# Altium schematic sheet [3]-DCDC-3V3.SchDoc: [3]-DCDC-3V3
size A3; DocumentNumber: NA; Revision: 2019.12.17; SheetNumber: 3; SheetTotal: 3
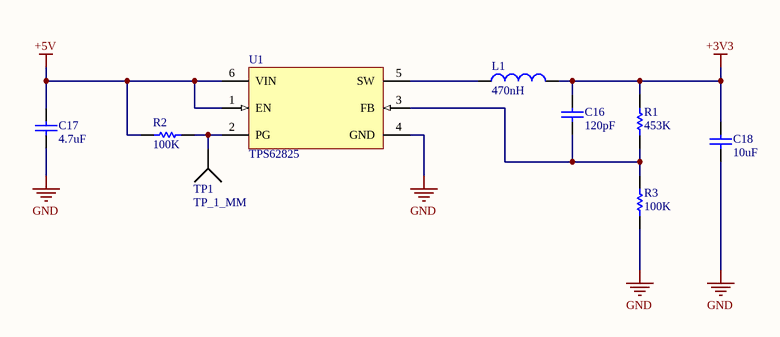
[diagram p0: [3]-DCDC-3V3.SchDoc]

## Parts
C16  120pF  [CAPC1005N]
C17  4.7uF  [CAPC2012N]
C18  10uF  [CAPC2012N]
L1  470nH  [IHLP-1212AE-11]
R1  453K  [RESC1005N]
R2  100K  [RESC1005N]
R3  100K  [RESC1005N]
TP1  TP_1_MM  [TP_1_MM]  (no BOM)
U1  TPS62825  [DMQ0006A]

## Nets
+3V3: C16.2 C18.2 L1.2 R1.2
+5V: C17.2 R2.1 U1.1(EN) U1.6(VIN)
GND: C17.1 C18.1 R3.1 U1.4(GND)
NetC16_1: C16.1 R1.1 R3.2 U1.3(FB)
NetL1_1: L1.1 U1.5(SW)
NetR2_2: R2.2 TP1.1 U1.2(PG)

## Library data of the parts
C16 = GRM1555C1H121FA01D: CAP CER 120PF 50V C0G/NP0 0402; Manufacturer 1: Murata; Description 1: Multilayer Ceramic Capacitors MLCC - SMD/SMT 0402 120pF 50volts 1%; Brand: Murata Electronics; Tolerance: 1 %; Dielectric: C0G (NP0); Case Height: 0.5 mm; Case Length: 1 mm; Temperature Coefficient / Code: +/- 30 PPM / C; Type: General Purpose MLCC; Material: Ceramic; Temperature Coefficient: 30ppm/°C; Supplier 1: Digi-Key; Stock 1: 154558; Pricing 1: 1=0.15, 10=0.107, 100=0.0501, 500=0.0351, 1000=0.0291, 2500=0.0271, 5000=0.0248 (USD); Voltage Rating: 50 V; Product Category: Multilayer Ceramic Capacitors MLCC - SMD/SMT; RoHS: Details; Capacitance: 120 pF; Voltage Rating DC: 50 V; Case Code - in: 0402; Case Code - mm: 1005; Minimum Operating Temperature: - 55 C; Maximum Operating Temperature: + 125 C; Product: General Type MLCCs; Case Width: 0.5 mm; Operating Temperature Range: - 55 C to + 125 C; Package / Case: 0402 (1005 metric); Packaging: Reel; Series: GRM; Factory Pack Quantity: 10000; Termination Style: SMD/SMT; Dimensions: 0.5 mm W x 1 mm L x 0.5 mm H; ComponentLink1URL: https://datasheet.ciiva.com/11617/c02e-11617455.pdf; ComponentLink1Description: https://datasheet.ciiva.com/11617/c02e-11617455.pdf; ComponentLink2URL: https://datasheet.ciiva.com/17451/c02e-17451502.pdf; ComponentLink2Description: https://datasheet.ciiva.com/17451/c02e-17451502.pdf; Supplier Part Number 1: 490-8182-1-ND; Supplier 2: Digi-Key; Manufacturer 2: Murata; Manufacturer Part Number 2: GRM1555C1H121JA01D; Stock 2: 100000; Pricing 2: 1=0.1, 10=0.065, 100=0.0289, 500=0.02066, 1000=0.01623, 2500=0.01475, 5000=0.01357 (USD); Mount: Surface Mount; Case/Package: 0402; Case Code (Imperial): 0402; Case Code (Metric): 1005; Min Operating Temperature: -55°C; Max Operating Temperature: 125°C; Voltage Rating (DC): 50V; Package Quantity: 1; Termination: SMD/SMT; Voltage: 50V; Length: 1mm; Height: 0.5mm; Width: 0.5mm; Thickness: 0.022inch; Depth: 0.5mm; Radiation Hardening: No; REACH SVHC: No SVHC; Lead Free: Lead Free; Manufacturer Part Number 1: GRM1555C1H121FA01D; Supplier Part Number 2: 490-1292-1-ND
C17 = C2012X5R1E475K125AB: CAP CER 4.7UF 25V X5R 0805; Manufacturer 1: TDK; Dielectric Material: Ceramic; Tolerance: 10%; Supplier 1: Digi-Key; Manufacturer Part Number 1: C2012X5R1E475K125AB; Stock 1: 20000; Pricing 1: 1=0.38, 10=0.259, 100=0.1466, 500=0.1035, 1000=0.09056 (USD); Mount: Surface Mount; Case/Package: 0805; Number of Pins: 2; Weight: 0.000194oz; Case Code (Imperial): 0805; Case Code (Metric): 2012; Min Operating Temperature: -55°C; Max Operating Temperature: 85°C; Capacitance: 4.7uF; Dielectric: X5R; Voltage Rating: 25V; Voltage Rating (DC): 25V; Packaging: Tape and Reel; Package Quantity: 1; Termination: SMD/SMT; Composition: Ceramic; Voltage: 25V; Length: 2mm; Height: 1.25mm; Depth: 1.25mm; Width: 1.25mm; Thickness: 0.057inch; Radiation Hardening: No; REACH SVHC: No SVHC; Lead Free: Lead Free; ComponentLink1URL: https://datasheet.ciiva.com/24216/tdkmlcccaprange-24216480.pdf; ComponentLink1Description: https://datasheet.ciiva.com/24216/tdkmlcccaprange-24216480.pdf; ComponentLink2URL: https://datasheet.ciiva.com/11788/0900766b80c1bb00-11788107.pdf; ComponentLink2Description: https://datasheet.ciiva.com/11788/0900766b80c1bb00-11788107.pdf; ComponentLink3URL: https://datasheet.ciiva.com/36857/1796654-36857301.pdf; ComponentLink3Description: https://datasheet.ciiva.com/36857/1796654-36857301.pdf; ComponentLink4URL: https://datasheet.ciiva.com/22773/1571323-22773430.pdf; ComponentLink4Description: https://datasheet.ciiva.com/22773/1571323-22773430.pdf; ComponentLink5URL: https://datasheet.ciiva.com/6251/tdkmlcccaprange-6251817.pdf; ComponentLink5Description: https://datasheet.ciiva.com/6251/tdkmlcccaprange-6251817.pdf; ComponentLink6URL: https://datasheet.ciiva.com/22676/1571323-22676937.pdf; ComponentLink6Description: https://datasheet.ciiva.com/22676/1571323-22676937.pdf; ComponentLink7URL: https://datasheet.ciiva.com/6251/tdkmlcccaprange-6251820.pdf; ComponentLink7Description: https://datasheet.ciiva.com/6251/tdkmlcccaprange-6251820.pdf; ComponentLink8URL: https://datasheet.ciiva.com/28602/1744655-28602173.pdf; ComponentLink8Description: https://datasheet.ciiva.com/28602/1744655-28602173.pdf; ComponentLink9URL: https://datasheet.ciiva.com/6251/tdkmlcccaprange-6251823.pdf; ComponentLink9Description: https://datasheet.ciiva.com/6251/tdkmlcccaprange-6251823.pdf; ComponentLink10URL: https://datasheet.ciiva.com/16449/e412-c-16449599.pdf; ComponentLink10Description: https://datasheet.ciiva.com/16449/e412-c-16449599.pdf; Supplier Part Number 1: 445-4116-1-ND
C18 = C2012X7R1A106K125AC: CAP CER 10UF 10V X7R 0805; Manufacturer 1: TDK; Dielectric Material: Ceramic; Tolerance: 10%; Supplier 1: Digi-Key; Manufacturer Part Number 1: C2012X7R1A106K125AC; Stock 1: 20000; Pricing 1: 1=0.52, 10=0.359, 100=0.2156, 500=0.16172, 1000=0.13656 (USD); Mount: Surface Mount; Case/Package: 0805; Number of Pins: 2; Weight: 0.000194oz; Case Code (Metric): 2012; Case Code (Imperial): 0805; Contact Plating: Matte,Tin; Min Operating Temperature: -55°C; Max Operating Temperature: 125°C; Capacitance: 10uF; Dielectric: X7R; Voltage Rating: 10V; Packaging: Tape and Reel; Voltage Rating (DC): 10V; Termination: SMD/SMT; Package Quantity: 1; Composition: Ceramic; Voltage: 10V; Length: 2mm; Height: 1.25mm; Width: 0.049inch; Depth: 1.25mm; Thickness: 0.057inch; Radiation Hardening: No; Lead Free: Lead Free; REACH SVHC: No SVHC; Supplier Part Number 1: 445-6857-1-ND
L1 = IHLP1212AEERR47M11: FIXED IND 470NH 6.7A 15 MOHM SMD; Manufacturer 1: Vishay Dale; Core Material: Ferrite; Tolerance: 20%; Self Resonant Frequency: 1MHz; Shielding: Shielded; DC Resistance (DCR): 15mR; Test Frequency: 100kHz; Supplier 1: Digi-Key; Manufacturer Part Number 1: IHLP1212AEERR47M11; Stock 1: 27366; Pricing 1: 1=1.41, 10=1.308, 100=0.9459, 500=0.7245, 1000=0.644 (USD); Mount: Surface Mount; Case/Package: 1212; Number of Pins: 2; Min Operating Temperature: -55°C; Max Operating Temperature: 125°C; Packaging: Tape and Reel; Inductance Tolerance: 20%; Package Quantity: 3000; Current Rating: 6.7A; Saturation Current: 6.7A; Inductance: 470nh; Max DC Current: 6.7A; Termination: SMD/SMT; RMS Current (Irms): 6.7A; Military Standard: Not; Length: 3.6mm; Height: 1.2mm; Width: 3mm; Height - Seated (Max): 0.059inch; Depth: 3.2mm; Radiation Hardening: No; REACH SVHC: Unknown; Lead Free: Lead Free; Supplier Part Number 1: 541-1330-1-ND
R1 = RMCF0402FT453K: RES SMD 453K OHM 1% 1/16W 0402; Manufacturer: Stackpole Electronics; Resistance: 453kR; Max Power Dissipation: 63mW; Temperature Coefficient: 100ppm/°C; Supplier 1: Digi-Key; Manufacturer Part Number: RMCF0402FT453K; Stock 1: 49261; Pricing 1: 1=0.10000, 10=0.01500, 100=0.00610, 1000=0.00275, 2500=0.00239, 5000=0.00198 (USD); RoHS: Yes; Mount: Surface Mount; Case/Package: 0402; Case Code (Metric): 1005; Case Code (Imperial): 0402; Contact Plating: Tin,Matte; Min Operating Temperature: -55°C; Max Operating Temperature: 155°C; Tolerance: 1%; Packaging: Tape and Reel; Composition: Thick Film; Number of Terminations: 2; Features: Automotive AEC-Q200; Length: 0.039inch; Height: 0.016inch; Width: 0.02inch; ComponentLink1URL: https://www.seielect.com/catalog/SEI-Packaging.pdf?src-supplier=Digi-Key; ComponentLink1Description: https://www.seielect.com/catalog/SEI-Packaging.pdf?src-supplier=Digi-Key; ComponentLink2URL: http://components.arrow.com/part/dataview/47827349S9775272N1174?src-supplier=Arrow; ComponentLink2Description: http://components.arrow.com/part/dataview/47827349S9775272N1174?src-supplier=Arrow; ComponentLink3URL: https://www.seielect.com/Catalog/SEI-RMCF_RMCP.pdf?src-supplier=Avnet; ComponentLink3Description: https://www.seielect.com/Catalog/SEI-RMCF_RMCP.pdf?src-supplier=Avnet; Supplier Part Number 1: RMCF0402FT453KCT-ND
R2 R3 = RC0402FR-07100KL: RES SMD 100K OHM 1% 1/16W 0402; Manufacturer 1: Yageo; Resistance: 100 kOhms; Power Rating: 62.5 mW (1/16 W); Voltage Rating: 50 V; Temperature Coefficient: 100 PPM / C; Supplier 1: Digi-Key; Manufacturer Part Number 1: RC0402FR-07100KL; Description 1: RES SMD 100K OHM 1% 1/16W 0402; Stock 1: 10691398; Pricing 1: 1=0.1, 10=0.014, 100=0.0056, 1000=0.0025, 2500=0.0022, 5000=0.0018 (USD); Termination Style: SMD/SMT; Product: Thick Film Resistors General Purpose; Tolerance: 1 %; Case Code - in: 0402; Case Code - mm: 1005; Series: RC; Operating Temperature Range: - 55 C to + 155 C; Packaging: Reel; ComponentLink1URL: https://datasheet.ciiva.com/11819/0900766b80c66297-11819452.pdf; ComponentLink1Description: https://datasheet.ciiva.com/11819/0900766b80c66297-11819452.pdf; ComponentLink2URL: https://datasheet.ciiva.com/16740/pyu-rc0402-51-rohs-l-6-r-16740567.pdf; ComponentLink2Description: https://datasheet.ciiva.com/16740/pyu-rc0402-51-rohs-l-6-r-16740567.pdf; ComponentLink3URL: https://datasheet.ciiva.com/12667/pyu-rc0402-51-rohs-l-6-r-12667930.pdf; ComponentLink3Description: https://datasheet.ciiva.com/12667/pyu-rc0402-51-rohs-l-6-r-12667930.pdf; ComponentLink4URL: https://datasheet.ciiva.com/2453/pyu-r-int-thick-7-2453361.pdf; ComponentLink4Description: https://datasheet.ciiva.com/2453/pyu-r-int-thick-7-2453361.pdf; ComponentLink5URL: https://datasheet.ciiva.com/15189/getdatasheetpartid-323696-15189334.pdf; ComponentLink5Description: https://datasheet.ciiva.com/15189/getdatasheetpartid-323696-15189334.pdf; ComponentLink6URL: https://datasheet.ciiva.com/2453/pyu-r-int-thick-7-2453362.pdf; ComponentLink6Description: https://datasheet.ciiva.com/2453/pyu-r-int-thick-7-2453362.pdf; ComponentLink7URL: https://datasheet.ciiva.com/2453/pyu-r-int-thick-7-2453363.pdf; ComponentLink7Description: https://datasheet.ciiva.com/2453/pyu-r-int-thick-7-2453363.pdf; ComponentLink8URL: https://datasheet.ciiva.com/22747/1018594-22747509.pdf; ComponentLink8Description: https://datasheet.ciiva.com/22747/1018594-22747509.pdf; Supplier Part Number 1: 311-100KLRCT-ND
U1 = IC_TPS62825DMQR: IC STEP DOWN CONV 1-5V 2A QFN; Manufacturer 1: Texas Instruments; Supplier 1: Digi-Key; Manufacturer Part Number 1: TPS62825DMQR; Stock 1: 1427; Pricing 1: 1=1.56, 10=1.392, 100=1.085, 500=0.8963, 1000=0.70761 (USD); Supplier Part Number 1: 296-49521-1-ND